# EAGLE design M837-pld-x (EAGLE 6.6.0)
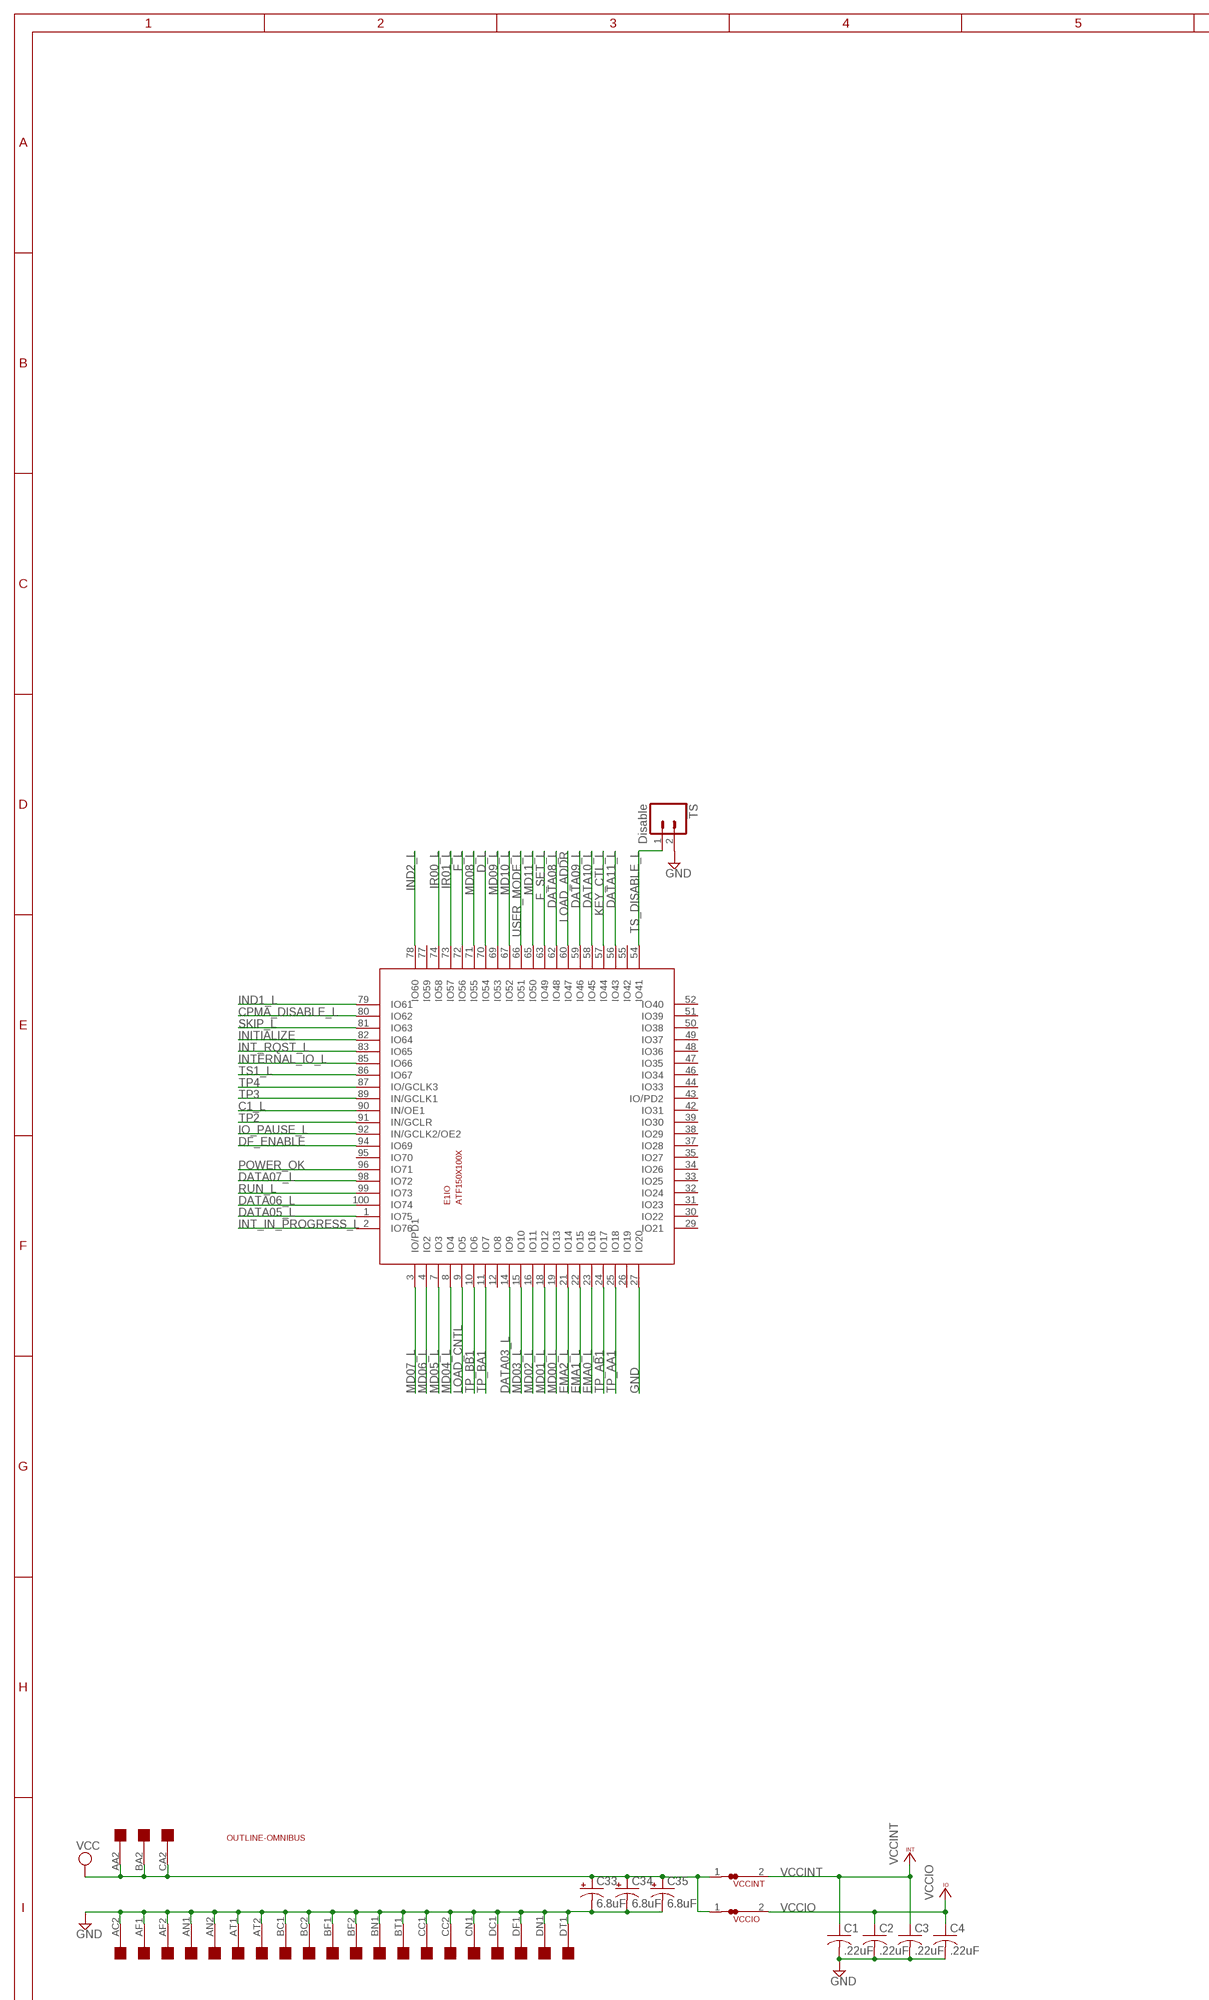
[diagram p0: schematic, sheet 1, part 1 of 2]
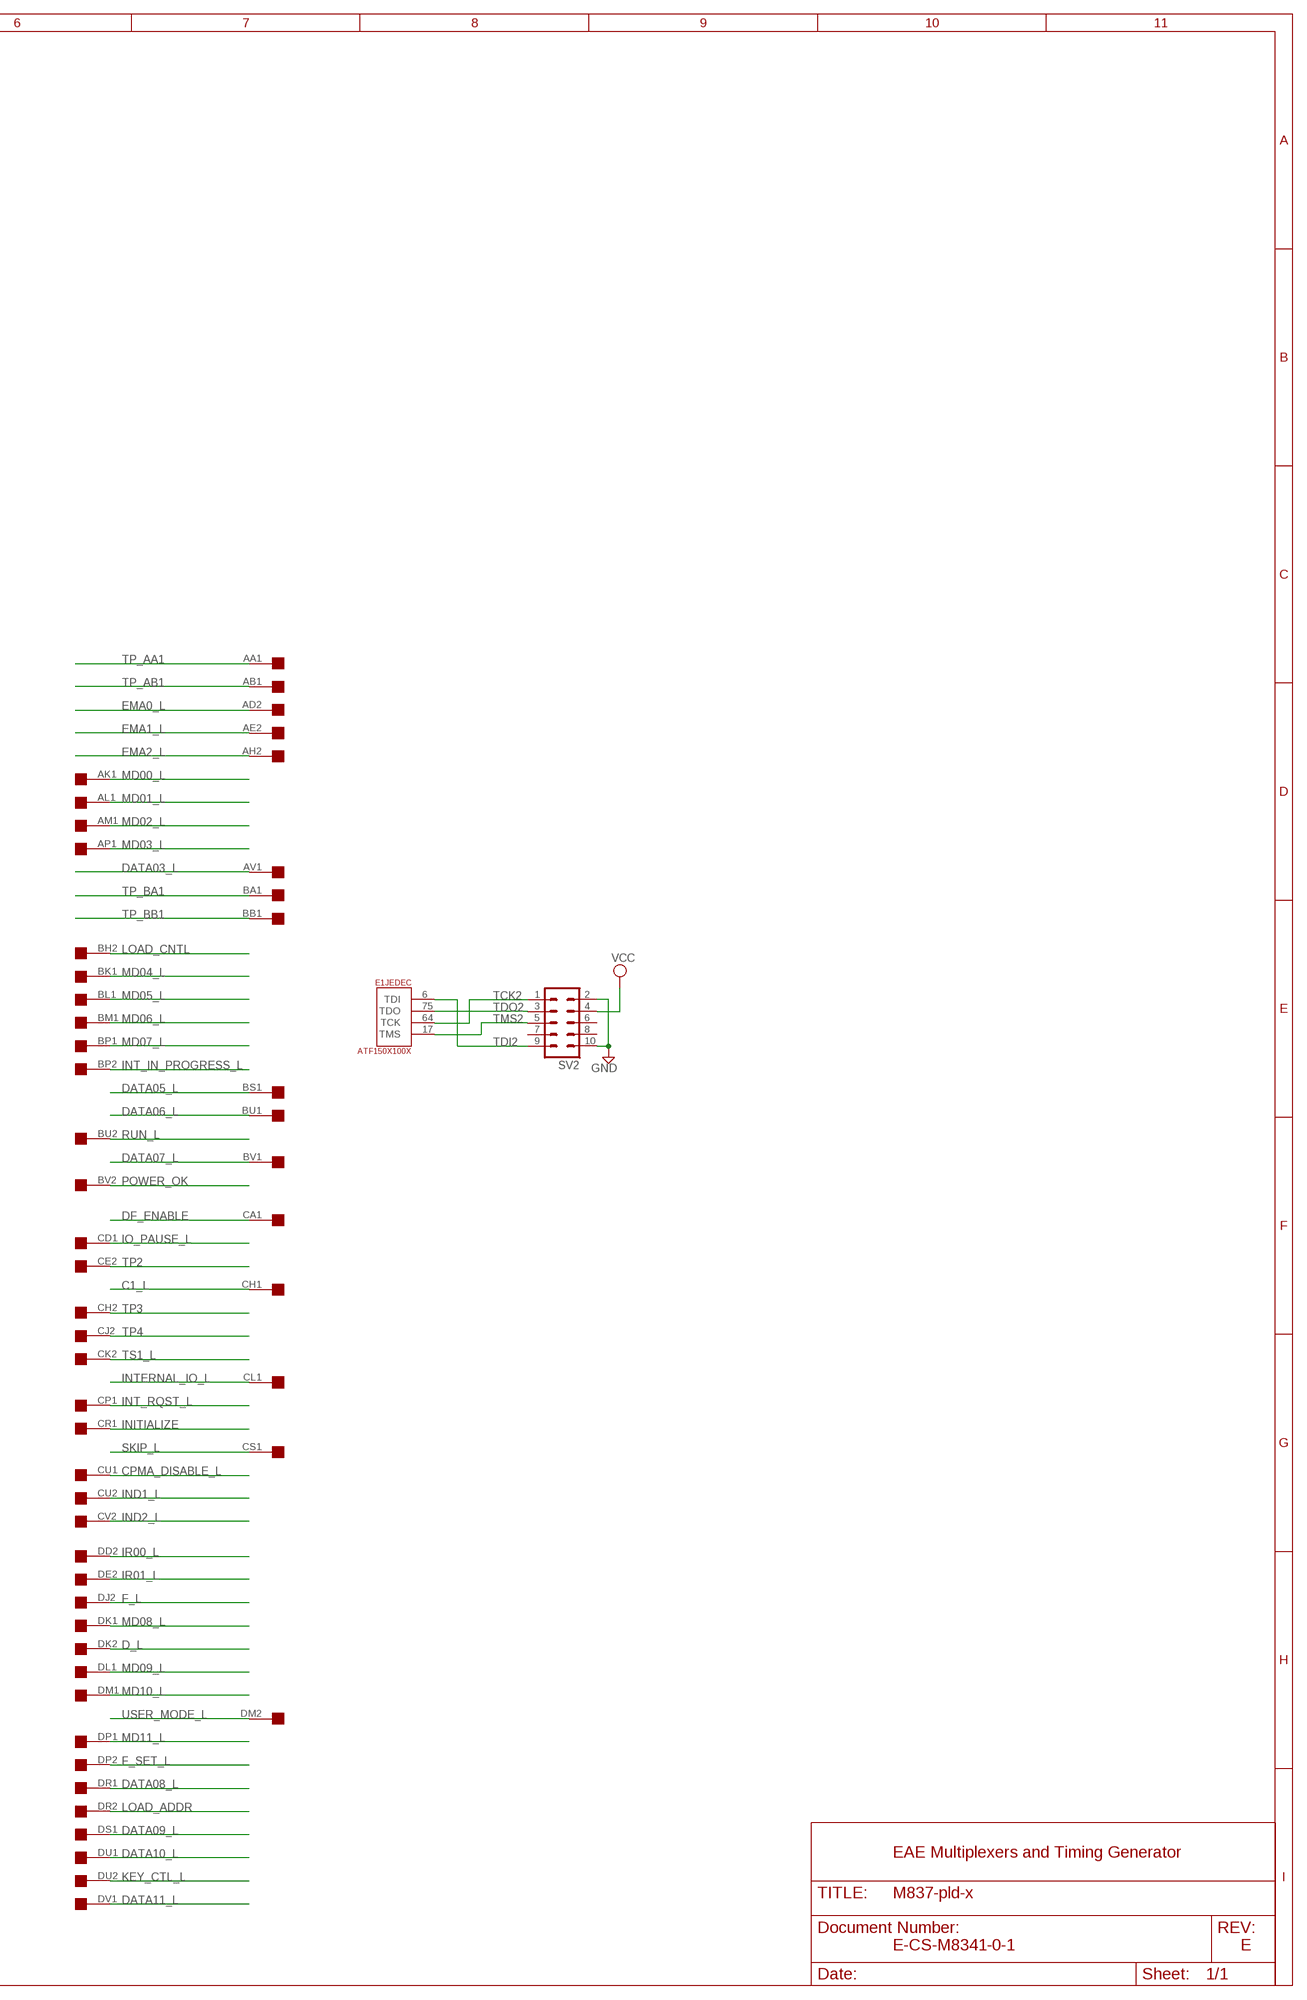
[diagram p1: schematic, sheet 1, part 2 of 2]

## Parts
!TS  Disable  M02  [02P]
C1  .22uF  C-US  [C063-025X075]
C2  .22uF  C-US  [C063-025X075]
C3  .22uF  C-US  [C063-025X075]
C4  .22uF  C-US  [C063-025X075]
C33  6.8uF  CPOL-USE20-8AXIAL  [E12-8]
C34  6.8uF  CPOL-USE20-8AXIAL  [E12-8]
C35  6.8uF  CPOL-USE20-8AXIAL  [E12-8]
E1  ATF150X100X  [TH100B]
SV2  ML10  [ML10]
U$1  QUAD  [EDGE-CON8]
U$2  OUTLINE-OMNIBUS  [OMNIBUS]
VCCINT  JUMPER-NC1  [NC1]
VCCIO  JUMPER-NC1  [NC1]

## Nets
C1_L: E1.90(IO:IN/OE1) U$1.CH1
CPMA_DISABLE_L: E1.80(IO:IO62) U$1.CU1
D_L: E1.70(IO:IO54) U$1.DK2
DATA03_L: E1.14(IO:IO9) U$1.AV1
DATA05_L: E1.1(IO:IO75) U$1.BS1
DATA06_L: E1.100(IO:IO74) U$1.BU1
DATA07_L: E1.98(IO:IO72) U$1.BV1
DATA08_L: E1.62(IO:IO48) U$1.DR1
DATA09_L: E1.59(IO:IO46) U$1.DS1
DATA10_L: E1.58(IO:IO45) U$1.DU1
DATA11_L: E1.56(IO:IO43) U$1.DV1
DF_ENABLE: E1.94(IO:IO69) U$1.CA1
EMA0_L: E1.23(IO:IO16) U$1.AD2
EMA1_L: E1.22(IO:IO15) U$1.AE2
EMA2_L: E1.21(IO:IO14) U$1.AH2
F_L: E1.72(IO:IO56) U$1.DJ2
F_SET_L: E1.63(IO:IO49) U$1.DP2
GND [supply]: !TS.2 C1.2 C2.2 C3.2 C4.2 C33.- C34.- C35.- E1.27(IO:IO20) SV2.2 SV2.10 U$1.AC2 U$1.AF1 U$1.AF2 U$1.AN1 U$1.AN2 U$1.AT1 U$1.AT2 U$1.BC1 U$1.BC2 U$1.BF1 U$1.BF2 U$1.BN1 U$1.BT1 U$1.CC1 U$1.CC2 U$1.CN1 U$1.DC1 U$1.DF1 U$1.DN1 U$1.DT1
IND1_L: E1.79(IO:IO61) U$1.CU2
IND2_L: E1.78(IO:IO60) U$1.CV2
INITIALIZE: E1.82(IO:IO64) U$1.CR1
INT_IN_PROGRESS_L: E1.2(IO:IO76) U$1.BP2
INT_RQST_L: E1.83(IO:IO65) U$1.CP1
INTERNAL_IO_L: E1.85(IO:IO66) U$1.CL1
IO_PAUSE_L: E1.92(IO:IN/GCLK2/OE2) U$1.CD1
IR00_L: E1.74(IO:IO58) U$1.DD2
IR01_L: E1.73(IO:IO57) U$1.DE2
KEY_CTL_L: E1.57(IO:IO44) U$1.DU2
LOAD_ADDR: E1.60(IO:IO47) U$1.DR2
LOAD_CNTL: E1.9(IO:IO5) U$1.BH2
MD00_L: E1.19(IO:IO13) U$1.AK1
MD01_L: E1.18(IO:IO12) U$1.AL1
MD02_L: E1.16(IO:IO11) U$1.AM1
MD03_L: E1.15(IO:IO10) U$1.AP1
MD04_L: E1.8(IO:IO4) U$1.BK1
MD05_L: E1.7(IO:IO3) U$1.BL1
MD06_L: E1.4(IO:IO2) U$1.BM1
MD07_L: E1.3(IO:IO/PD1) U$1.BP1
MD08_L: E1.71(IO:IO55) U$1.DK1
MD09_L: E1.69(IO:IO53) U$1.DL1
MD10_L: E1.67(IO:IO52) U$1.DM1
MD11_L: E1.65(IO:IO50) U$1.DP1
POWER_OK: E1.96(IO:IO71) U$1.BV2
RUN_L: E1.99(IO:IO73) U$1.BU2
SKIP_L: E1.81(IO:IO63) U$1.CS1
TCK2: E1.64(JEDEC:TCK) SV2.1
TDI2: E1.6(JEDEC:TDI) SV2.9
TDO2: E1.75(JEDEC:TDO) SV2.3
TMS2: E1.17(JEDEC:TMS) SV2.5
TP2: E1.91(IO:IN/GCLR) U$1.CE2
TP3: E1.89(IO:IN/GCLK1) U$1.CH2
TP4: E1.87(IO:IO/GCLK3) U$1.CJ2
TP_AA1: E1.25(IO:IO18) U$1.AA1
TP_AB1: E1.24(IO:IO17) U$1.AB1
TP_BA1: E1.11(IO:IO7) U$1.BA1
TP_BB1: E1.10(IO:IO6) U$1.BB1
TS1_L: E1.86(IO:IO67) U$1.CK2
TS_DISABLE_L: !TS.1 E1.54(IO:IO41)
USER_MODE_L: E1.66(IO:IO51) U$1.DM2
VCC [supply]: C33.+ C34.+ C35.+ SV2.4 U$1.AA2 U$1.BA2 U$1.CA2 VCCINT.1 VCCIO.1
VCCINT [supply]: C1.1 C3.1 VCCINT.2
VCCIO [supply]: C2.1 C4.1 VCCIO.2
Unconnected: E1.12(IO:IO8) E1.26(IO:IO19) E1.29(IO:IO21) E1.30(IO:IO22) E1.31(IO:IO23) E1.32(IO:IO24) E1.33(IO:IO25) E1.34(IO:IO26) E1.35(IO:IO27) E1.37(IO:IO28) E1.38(IO:IO29) E1.39(IO:IO30) E1.42(IO:IO31) E1.43(IO:IO/PD2) E1.44(IO:IO33) E1.46(IO:IO34) E1.47(IO:IO35) E1.48(IO:IO36) E1.49(IO:IO37) E1.50(IO:IO38) E1.51(IO:IO39) E1.52(IO:IO40) E1.55(IO:IO42) E1.77(IO:IO59) E1.95(IO:IO70) SV2.6 SV2.7 SV2.8 U$1.AB2 U$1.AC1 U$1.AD1 U$1.AE1 U$1.AH1 U$1.AJ1 U$1.AJ2 U$1.AK2 U$1.AL2 U$1.AM2 U$1.AP2 U$1.AR1 U$1.AR2 U$1.AS1 U$1.AS2 U$1.AU1 U$1.AU2 U$1.AV2 U$1.BB2 U$1.BD1 U$1.BD2 U$1.BE1 U$1.BE2 U$1.BH1 U$1.BJ1 U$1.BJ2 U$1.BK2 U$1.BL2 U$1.BM2 U$1.BN2 U$1.BR1 U$1.BR2 U$1.BS2 U$1.BT2 U$1.CB1 U$1.CB2 U$1.CD2 U$1.CE1 U$1.CF1 U$1.CF2 U$1.CJ1 U$1.CK1 U$1.CL2 U$1.CM1 U$1.CM2 U$1.CN2 U$1.CP2 U$1.CR2 U$1.CS2 U$1.CT1 U$1.CT2 U$1.CV1 U$1.DA1 U$1.DA2 U$1.DB1 U$1.DB2 U$1.DC2 U$1.DD1 U$1.DE1 U$1.DF2 U$1.DH1 U$1.DH2 U$1.DJ1 U$1.DL2 U$1.DN2 U$1.DS2 U$1.DT2 U$1.DV2

## Notes on the sheet
- EAE Multiplexers and Timing Generator
- E-CS-M8341-0-1 | E

## Power pins joined to a net without a drawn wire
GND: E1.13(GND) E1.28(GND) E1.40(GND) E1.45(GND) E1.61(GND) E1.76(GND) E1.88(GND) E1.97(GND) E1.P$24(GND) E1.P$26(GND) E1.P$28(GND) E1.P$30(GND)
VCCINT: E1.41(VCCINT) E1.93(VCCINT) E1.P$23(VCCINT) E1.P$25(VCCINT)
VCCIO: E1.5(VCCIO) E1.20(VCCIO) E1.36(VCCIO) E1.53(VCCIO) E1.68(VCCIO) E1.84(VCCIO) E1.P$27(VCCIO) E1.P$29(VCCIO) E1.VCCIO@1(VCCIO) E1.VCCIO@2(VCCIO)

## Library data of the parts
!TS = con-amp-quick:M02: AMP QUICK CONNECTOR; OC_FARNELL: unknown; OC_NEWARK: unknown
C1-C4 = dec-con:C-US: Capacitors with funky DEC lead spacing.
C33-C35 = dec-con:CPOL-USE20-8AXIAL: A 0.8 inch electrolytic.
E1 = atmel-cpld:ATF150X100: ATF150x in 100 pin package.
SV2 = con-harting-ml:ML10: HARTING; OC_FARNELL: unknown; OC_NEWARK: unknown
U$1 = dec-con:QUAD: Quad-Height DEC board
U$2 = dec-con:OUTLINE-*: Board outlines for DEC boards.
VCCINT VCCIO = dec-con:JUMPER: Normally closed SMD Jumper (Generates a DRC error.)

## Net classes
0 default: width 0.381 mm
1 supply: width 0.381 mm

## Board
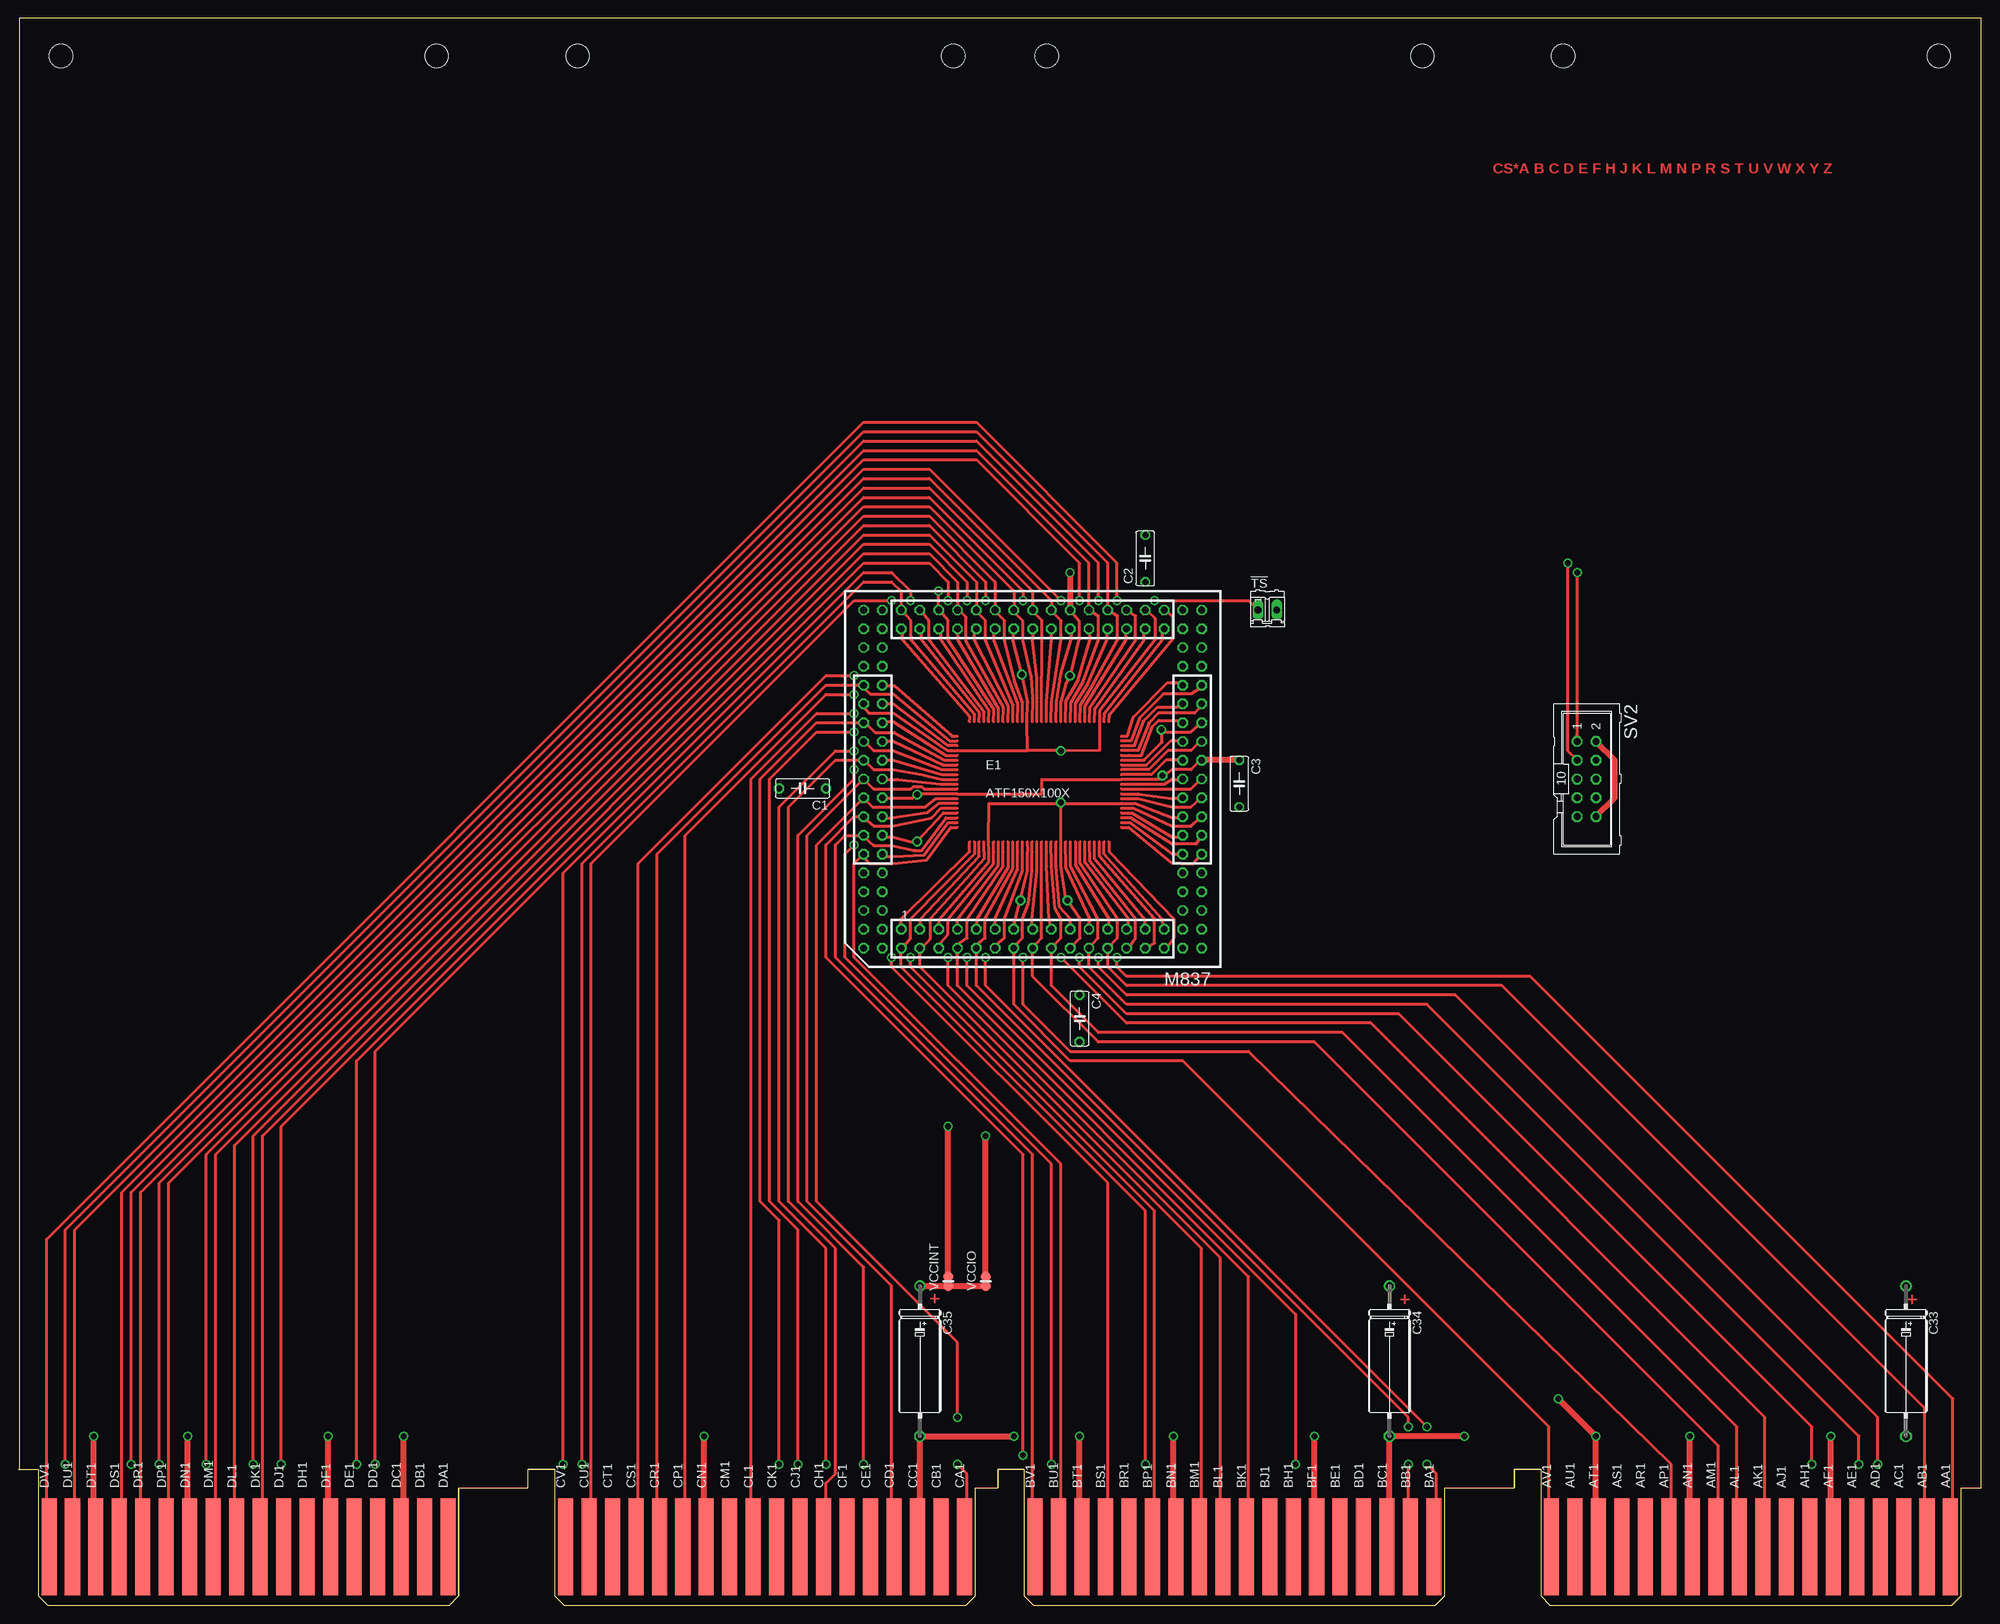
[diagram p2: board, top side]
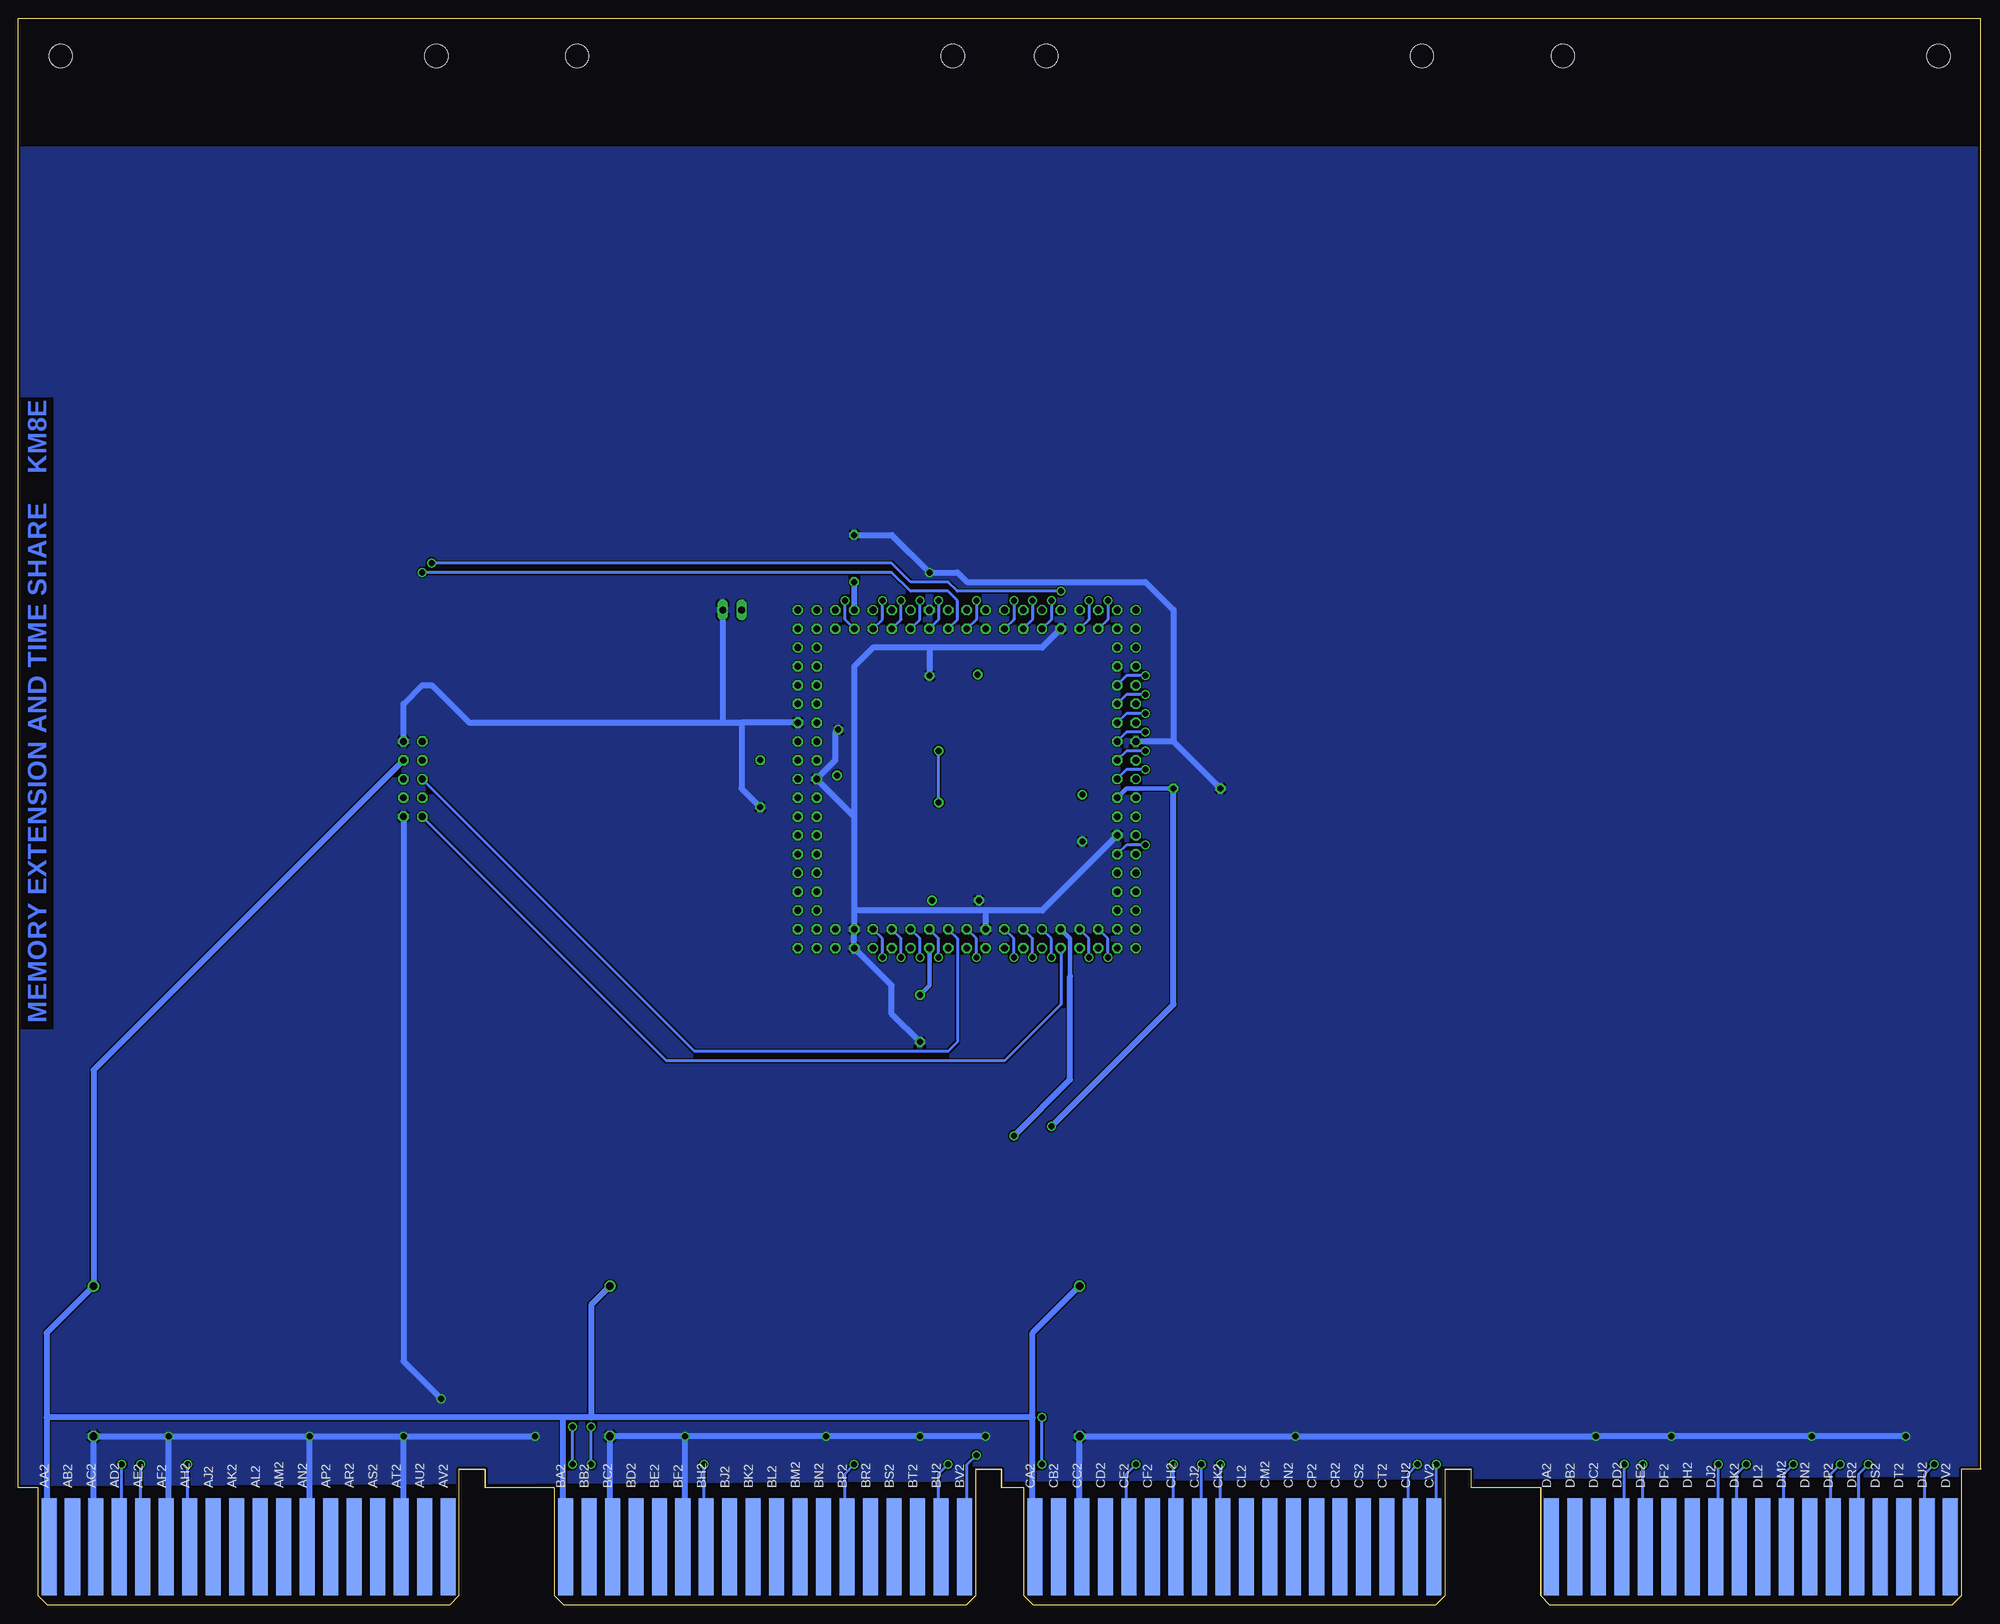
[diagram p3: board, bottom side, seen from below]

Size 265.43 x 214.63 mm. Coordinates in mm from the lower left corner, seen from the top.
Outline: 0,18.41 0.64,18.41
Copper layers (1+16): Top 0.035mm / dielectric 1.5mm / Bottom 0.035mm
Design rules "16mils *": minimum track width 16mil, minimum drill 32mil, track to track 7mil, track to pad 8mil, pad to pad 8mil, via to via 10mil, smd to smd 7mil, copper to edge 13mil, drill to drill 10mil, minimum pad ring 10mil, minimum via ring 8mil, stop-mask expansion 0mil, vias tented up to drill 0mil, thermal gap 10mil

### Footprints (pad centres in the part's own frame; a part is rotated, then mirrored left to right if it is on the bottom)
02P = drill 0.914 long: 1 -1.27,0; 2 1.27,0
C063-025X075 = drill 0.813 octagon: 1 -2.54,0; 2 3.81,0
E12-8 = drill 1.016: + -10.16,0 | drill 1.016 octagon: - 10.16,0
TH100B = drill 0.9 octagon: 1 -17.78,-20.32; 2 -17.78,-22.86; 3 -15.24,-20.32; 4 -15.24,-22.86; 5 -12.7,-20.32; 6 -12.7,-22.86; 7 -10.16,-20.32; 8 -10.16,-22.86; 9 -7.62,-20.32; 10 -7.62,-22.86; 11 -5.08,-20.32; 12 -5.08,-22.86; 13 -2.54,-20.32; 14 -2.54,-22.86; 15 0,-20.32; 16 0,-22.86; 17 2.54,-20.32; 18 2.54,-22.86; 19 5.08,-20.32; 20 5.08,-22.86; 21 7.62,-20.32; 22 7.62,-22.86; 23 10.16,-20.32; 24 10.16,-22.86; 25 12.7,-20.32; 26 12.7,-22.86; 27 15.24,-20.32; 28 15.24,-22.86; 29 17.78,-20.32; 30 17.78,-22.86; 31 22.86,-10.16; 32 20.32,-10.16; 33 22.86,-7.62; 34 20.32,-7.62; 35 22.86,-5.08; 36 20.32,-5.08; 37 22.86,-2.54; 38 20.32,-2.54; 39 22.86,0; 40 20.32,0; 41 22.86,2.54; 42 20.32,2.54; 43 22.86,5.08; 44 20.32,5.08; 45 22.86,7.62; 46 20.32,7.62; 47 22.86,10.16; 48 20.32,10.16; 49 22.86,12.7; 50 20.32,12.7; 51 17.78,22.86; 52 17.78,20.32; 53 15.24,22.86; 54 15.24,20.32; 55 12.7,22.86; 56 12.7,20.32; 57 10.16,22.86; 58 10.16,20.32; 59 7.62,22.86; 60 7.62,20.32; 61 5.08,22.86; 62 5.08,20.32; 63 2.54,22.86; 64 2.54,20.32; 65 0,22.86; 66 0,20.32; 67 -2.54,22.86; 68 -2.54,20.32; 69 -5.08,22.86; 70 -5.08,20.32; 71 -7.62,22.86; 72 -7.62,20.32; 73 -10.16,22.86; 74 -10.16,20.32; 75 -12.7,22.86; 76 -12.7,20.32; 77 -15.24,22.86; 78 -15.24,20.32; 79 -17.78,22.86; 80 -17.78,20.32; 81 -20.32,12.7; 82 -22.86,12.7; 83 -20.32,10.16; 84 -22.86,10.16; 85 -20.32,7.62; 86 -22.86,7.62; 87 -20.32,5.08; 88 -22.86,5.08; 89 -20.32,2.54; 90 -22.86,2.54; 91 -20.32,0; 92 -22.86,0; 93 -20.32,-2.54; 94 -22.86,-2.54; 95 -20.32,-5.08; 96 -22.86,-5.08; 97 -20.32,-7.62; 98 -22.86,-7.62; 99 -20.32,-10.16; 100 -22.86,-10.16; P$1 -22.86,15.24; P$2 -20.32,15.24; P$3 -20.32,17.78; P$4 -22.86,17.78; P$5 -20.32,20.32; P$6 -22.86,20.32; P$7 -22.86,22.86; P$8 -20.32,22.86; P$9 20.32,15.24; P$10 22.86,15.24; P$11 20.32,17.78; P$12 22.86,17.78; P$13 20.32,20.32; P$14 22.86,20.32; P$15 20.32,22.86; P$16 22.86,22.86; P$17 20.32,-17.78; P$18 22.86,-17.78; P$19 20.32,-15.24; P$20 22.86,-15.24; P$21 20.32,-12.7; P$22 22.86,-12.7; P$31 20.32,-22.86; P$32 22.86,-22.86; P$33 22.86,-20.32; P$34 20.32,-20.32; P$35 -20.32,-22.86; P$36 -20.32,-20.32; P$37 -22.86,-20.32; P$38 -22.86,-22.86; P$39 -22.86,-17.78; P$40 -20.32,-17.78; P$41 -22.86,-15.24; P$42 -20.32,-15.24; P$43 -22.86,-12.7; P$44 -20.32,-12.7 | drill 0.813: P$23 17.556,0.488; P$24 17.394,6.665; P$25 -15.606,-2.113; P$26 -15.606,-8.453; P$27 4.714,-16.419; P$28 -1.626,-16.419; P$29 -1.463,14.143; P$30 5.039,13.98; VCCIO@1 3.81,3.81; VCCIO@2 3.81,-3.175
ML10 = drill 0.914 octagon: 1 -5.08,-1.27; 2 -5.08,1.27; 3 -2.54,-1.27; 4 -2.54,1.27; 5 0,-1.27; 6 0,1.27; 7 2.54,-1.27; 8 2.54,1.27; 9 5.08,-1.27; 10 5.08,1.27
EDGE-CON8 = smd 2.032 x 13.106: AA1 261.303,7.938; AB1 258.127,7.938; AC1 254.952,7.938; AD1 251.778,7.938; AE1 248.602,7.938; AF1 245.428,7.938; AH1 242.252,7.938; AJ1 239.077,7.938; AK1 235.903,7.938; AL1 232.727,7.938; AM1 229.553,7.938; AN1 226.377,7.938; AP1 223.202,7.938; AR1 220.028,7.938; AS1 216.852,7.938; AT1 213.678,7.938; AU1 210.502,7.938; AV1 207.327,7.938; BA1 191.452,7.938; BB1 188.278,7.938; BC1 185.102,7.938; BD1 181.928,7.938; BE1 178.752,7.938; BF1 175.577,7.938; BH1 172.403,7.938; BJ1 169.227,7.938; BK1 166.053,7.938; BL1 162.877,7.938; BM1 159.702,7.938; BN1 156.528,7.938; BP1 153.352,7.938; BR1 150.178,7.938; BS1 147.002,7.938; BT1 143.827,7.938; BU1 140.653,7.938; BV1 137.477,7.938; CA1 127.953,7.938; CB1 124.778,7.938; CC1 121.603,7.938; CD1 118.427,7.938; CE1 115.252,7.938; CF1 112.078,7.938; CH1 108.903,7.938; CJ1 105.728,7.938; CK1 102.552,7.938; CL1 99.377,7.938; CM1 96.203,7.938; CN1 93.028,7.938; CP1 89.853,7.938; CR1 86.677,7.938; CS1 83.502,7.938; CT1 80.328,7.938; CU1 77.153,7.938; CV1 73.978,7.938; DA1 58.102,7.938; DB1 54.928,7.938; DC1 51.752,7.938; DD1 48.578,7.938; DE1 45.403,7.938; DF1 42.227,7.938; DH1 39.053,7.938; DJ1 35.877,7.938; DK1 32.703,7.938; DL1 29.527,7.938; DM1 26.352,7.938; DN1 23.177,7.938; DP1 20.003,7.938; DR1 16.828,7.938; DS1 13.652,7.938; DT1 10.477,7.938; DU1 7.303,7.938; DV1 4.128,7.938 | smd 2.032 x 13.106 bottom: AA2 261.303,7.938; AB2 258.127,7.938; AC2 254.952,7.938; AD2 251.778,7.938; AE2 248.602,7.938; AF2 245.428,7.938; AH2 242.252,7.938; AJ2 239.077,7.938; AK2 235.903,7.938; AL2 232.727,7.938; AM2 229.553,7.938; AN2 226.377,7.938; AP2 223.202,7.938; AR2 220.028,7.938; AS2 216.852,7.938; AT2 213.678,7.938; AU2 210.502,7.938; AV2 207.327,7.938; BA2 191.452,7.938; BB2 188.278,7.938; BC2 185.102,7.938; BD2 181.928,7.938; BE2 178.752,7.938; BF2 175.577,7.938; BH2 172.403,7.938; BJ2 169.227,7.938; BK2 166.053,7.938; BL2 162.877,7.938; BM2 159.702,7.938; BN2 156.528,7.938; BP2 153.352,7.938; BR2 150.178,7.938; BS2 147.002,7.938; BT2 143.827,7.938; BU2 140.653,7.938; BV2 137.477,7.938; CA2 127.953,7.938; CB2 124.778,7.938; CC2 121.603,7.938; CD2 118.427,7.938; CE2 115.252,7.938; CF2 112.078,7.938; CH2 108.903,7.938; CJ2 105.728,7.938; CK2 102.552,7.938; CL2 99.377,7.938; CM2 96.203,7.938; CN2 93.028,7.938; CP2 89.853,7.938; CR2 86.677,7.938; CS2 83.502,7.938; CT2 80.328,7.938; CU2 77.153,7.938; CV2 73.978,7.938; DA2 58.102,7.938; DB2 54.928,7.938; DC2 51.752,7.938; DD2 48.578,7.938; DE2 45.403,7.938; DF2 42.227,7.938; DH2 39.053,7.938; DJ2 35.877,7.938; DK2 32.703,7.938; DL2 29.527,7.938; DM2 26.352,7.938; DN2 23.177,7.938; DP2 20.003,7.938; DR2 16.828,7.938; DS2 13.652,7.938; DT2 10.477,7.938; DU2 7.303,7.938; DV2 4.128,7.938
OMNIBUS = hole 3.175: 208.915,209.55; 259.715,209.55; 189.865,209.55; 139.065,209.55; 75.616,209.55; 126.416,209.55; 56.566,209.55; 5.766,209.55
NC1 = smd 1.346 x 1.346: 1 -0.635,0; 2 0.635,0

### Placement (x,y rotation side)
!TS  168.91,134.62 0 top
C1  106.68,110.49 180 top
C2  152.4,140.97 90 top
C3  165.1,111.76 270 top
C4  143.51,80.01 270 top
C33  255.27,33.02 270 top
C34  185.42,33.02 270 top
C35  121.92,33.02 270 top
E1  137.16,111.76 0 top
SV2  212.09,111.76 270 top
U$1  0,0 0 top
U$2  0,0 0 top
VCCINT  125.73,43.81 90 top
VCCIO  130.81,43.81 90 top

### Tracks (layer width: path | path; a pad name or v marks a point on that pad's centre or on a via)
C1_L
  Top 0.406: U$1.CH1 108.9,8.57 109.22,8.89 109.22,16.51 110.49,17.78 110.49,48.26 104.14,54.61 104.14,107.95 110.49,114.3 E1.90
CPMA_DISABLE_L  (via drill 0.81)
  Top 0.406: U$1.CU1 77.15,9.84 77.47,10.16 77.47,100.33 113.03,135.89 v118.11,135.89
  Bottom 0.406: v118.11,135.89 118.11,133.35 E1.80
D_L  (via drill 0.81)
  Top 0.406: v31.75,19.05 31.75,63.5 114.3,146.05 123.19,146.05 130.81,138.43 v130.81,135.89
  Bottom 0.406: U$1.DK2 32.7,8.57 33.02,8.89 33.02,17.78 v31.75,19.05 | v130.81,135.89 130.81,133.35 E1.70
DATA03_L
  Top 0.406: U$1.AV1 207.33,8.57 207.01,8.89 207.01,24.13 157.48,73.66 142.24,73.66 134.62,81.28 E1.14
DATA05_L  (via drill 0.81)
  Top 0.406: U$1.BS1 147,9.84 147.32,10.16 147.32,57.15 118.11,86.36 v118.11,87.63
  Bottom 0.406: v118.11,87.63 118.11,90.17 E1.1
DATA06_L
  Top 0.406: U$1.BU1 140.65,8.57 140.97,8.89 140.97,59.69 113.03,87.63 113.03,100.33 E1.100
DATA07_L
  Top 0.406: U$1.BV1 137.48,8.57 137.16,8.89 137.16,60.96 110.49,87.63 110.49,102.87 111.76,104.14 E1.98
DATA08_L  (via drill 0.81)
  Top 0.406: U$1.DR1 16.51,7.62 16.51,55.88 114.3,153.67 123.19,153.67 v140.97,135.89
  Bottom 0.406: v140.97,135.89 140.97,133.35 E1.62
DATA09_L
  Top 0.406: U$1.DS1 13.65,8.57 13.97,8.89 13.97,55.88 114.3,156.21 129.54,156.21 144.78,140.97 E1.59
DATA10_L  (via drill 0.81)
  Top 0.406: U$1.DU1 7.3,8.57 7.62,8.89 7.62,50.8 114.3,157.48 129.54,157.48 146.05,140.97 v146.05,135.89
  Bottom 0.406: E1.58 146.05,133.35 v146.05,135.89
DATA11_L  (via drill 0.81)
  Top 0.406: U$1.DV1 3.81,7.94 3.81,49.53 114.3,160.02 129.54,160.02 148.59,140.97 v148.59,135.89
  Bottom 0.406: E1.56 148.59,133.35 v148.59,135.89
DF_ENABLE  (via drill 0.81)
  Top 0.406: U$1.CA1 127.95,8.57 128.27,8.89 128.27,17.78 v127,19.05 | v127,25.4 127,35.56 107.95,54.61 107.95,102.87 E1.94
  Bottom 0.406: v127,19.05 v127,25.4
EMA0_L  (via drill 0.81)
  Top 0.406: v251.46,19.05 251.46,25.4 194.31,82.55 149.86,82.55 146.05,86.36 v146.05,87.63
  Bottom 0.406: U$1.AD2 251.78,8.57 251.46,8.89 v251.46,19.05 | v146.05,87.63 146.05,90.17 E1.23
EMA1_L  (via drill 0.81)
  Top 0.406: v248.92,19.05 248.92,22.86 190.5,81.28 149.86,81.28 144.78,86.36 E1.22
  Bottom 0.406: U$1.AE2 248.6,9.84 248.92,10.16 v248.92,19.05
EMA2_L  (via drill 0.81)
  Top 0.406: v242.57,19.05 242.57,24.13 186.69,80.01 149.86,80.01 143.51,86.36 v143.51,87.63
  Bottom 0.406: U$1.AH2 242.25,8.57 242.57,8.89 v242.57,19.05 | v143.51,87.63 143.51,90.17 E1.21
F_L  (via drill 0.81)
  Top 0.406: v35.56,19.05 35.56,64.77 114.3,143.51 123.19,143.51 128.27,138.43 v128.27,135.89
  Bottom 0.406: U$1.DJ2 35.56,8.89 v35.56,19.05 | v128.27,135.89 128.27,133.35 E1.72
F_SET_L  (via drill 0.81)
  Top 0.406: v19.05,19.05 19.05,57.15 114.3,152.4 123.19,152.4 139.7,135.89 E1.63
  Bottom 0.406: U$1.DP2 20,8.57 20.32,8.89 20.32,17.78 v19.05,19.05
GND  (via drill 0.81, 0.81 pad 0.3)
  Top 0.813: U$1.DT1 10.16,8.89 v10.16,22.86 | v195.58,22.86 C34.- 185.42,8.89 U$1.BC2 | U$1.DN1 22.86,7.62 v22.86,22.86 | U$1.DF1 41.91,8.89 v41.91,22.86 | U$1.DC1 52.07,8.89 v52.07,22.86 | v134.62,22.86 C35.- 121.92,8.89 U$1.CC2 | U$1.CN1 92.71,8.89 v92.71,22.86 | U$1.BF2 175.26,8.89 v175.26,22.86 | U$1.BN1 156.21,8.89 v156.21,22.86 | U$1.BT1 143.51,8.89 v143.51,22.86 | U$1.AT1 213.68,8.57 213.36,8.89 v213.36,22.86 v208.28,27.94 | U$1.AN1 226.38,8.57 226.06,8.89 v226.06,22.86 | U$1.AF1 245.43,8.57 245.11,8.89 v245.11,22.86 | v142.24,139.7 E1.61 | SV2.10 215.9,109.22 215.9,114.3 SV2.2
  Bottom 0.813: v10.16,22.86 v22.86,22.86 v41.91,22.86 v52.07,22.86 v92.71,22.86 C35.- 121.92,8.89 U$1.CC2 | v245.11,22.86 C33.- 255.27,10.16 U$1.AC2 | v245.11,22.86 v226.06,22.86 | v226.06,22.86 v213.36,22.86 | v213.36,22.86 v195.58,22.86 | v134.62,22.86 v143.51,22.86 v156.21,22.86 v175.26,22.86 | U$1.BF2 175.26,8.89 v175.26,22.86 | U$1.BC2 185.42,8.89 C34.- v175.26,22.86 | U$1.AT1 213.68,8.57 213.36,8.89 v213.36,22.86 | U$1.AN1 226.38,8.57 226.06,8.89 v226.06,22.86 | U$1.AF1 245.43,8.57 245.11,8.89 v245.11,22.86 | C4.2 147.32,80.01 147.32,83.82 E1.28 E1.27 152.4,93.98 | C1.2 109.22,116.84 | C2.2 147.32,144.78 v142.24,139.7 138.43,139.7 137.16,138.43 113.03,138.43 109.22,134.62 109.22,116.84 | E1.45 167.64,119.38 | 167.64,119.38 167.64,110.49 C3.2 | 109.22,116.84 E1.88 | E1.97 127,93.98 134.62,93.98 | 134.62,93.98 E1.13 | 134.62,93.98 152.4,93.98 | 152.4,106.68 E1.40 154.94,114.3 154.94,118.04 E1.P$24 | 152.4,106.68 152.4,93.98 | E1.76 127,129.54 142.24,129.54 | 142.24,129.54 149.86,129.54 152.4,127 152.4,106.68 | SV2.2 213.36,121.92 210.82,124.46 209.55,124.46 204.47,119.38 170.18,119.38 | 170.18,119.38 167.64,119.38 | !TS.2 170.18,119.38 | SV2.10 213.36,33.02 v208.28,27.94 | 142.24,129.54 142.24,125.78 E1.P$30
  pour Bottom: 0,17.78 0,196.85 265.43,196.85 265.43,163.83 260.35,163.83 260.35,77.47 265.43,77.47 265.43,16.51
IND1_L  (via drill 0.81)
  Top 0.406: v76.2,19.05 76.2,100.33 114.3,138.43 118.11,138.43 119.38,137.16 E1.79
  Bottom 0.406: U$1.CU2 77.15,8.57 77.47,8.89 77.47,17.78 v76.2,19.05
IND2_L  (via drill 0.81)
  Top 0.406: v73.66,19.05 73.66,99.06 114.3,139.7 118.11,139.7 120.65,137.16 v120.65,135.89
  Bottom 0.406: U$1.CV2 73.98,9.84 73.66,10.16 v73.66,19.05 | v120.65,135.89 120.65,133.35 E1.78
INITIALIZE
  Top 0.406: U$1.CR1 86.68,8.57 86.36,8.89 86.36,101.6 109.22,124.46 E1.82
INT_IN_PROGRESS_L  (via drill 0.81)
  Top 0.406: v152.4,19.05 152.4,53.34 119.38,86.36 E1.2
  Bottom 0.406: U$1.BP2 153.35,8.57 153.67,8.89 153.67,17.78 v152.4,19.05
INT_RQST_L  (via drill 0.81)
  Top 0.406: U$1.CP1 89.85,8.57 90.17,8.89 90.17,104.14 109.22,123.19 v113.03,123.19
  Bottom 0.406: v113.03,123.19 115.57,123.19 E1.83
INTERNAL_IO_L  (via drill 0.81)
  Top 0.406: U$1.CL1 99.38,8.57 99.06,8.89 99.06,111.76 107.95,120.65 v113.03,120.65
  Bottom 0.406: v113.03,120.65 115.57,120.65 E1.85
IO_PAUSE_L
  Top 0.406: U$1.CD1 118.43,8.57 118.11,8.89 118.11,43.18 106.68,54.61 106.68,104.14 E1.92
IR00_L  (via drill 0.81)
  Top 0.406: v48.26,19.05 48.26,74.93 114.3,140.97 123.19,140.97 125.73,138.43 v125.73,135.89
  Bottom 0.406: U$1.DD2 48.58,8.57 48.26,8.89 v48.26,19.05 | v125.73,135.89 125.73,133.35 E1.74
IR01_L  (via drill 0.81)
  Top 0.406: v45.72,19.05 45.72,73.66 114.3,142.24 123.19,142.24 127,138.43 E1.73
  Bottom 0.406: U$1.DE2 45.4,9.84 45.72,10.16 v45.72,19.05
KEY_CTL_L  (via drill 0.81)
  Top 0.406: v6.35,19.05 6.35,50.8 114.3,158.75 129.54,158.75 147.32,140.97 E1.57
  Bottom 0.406: U$1.DU2 7.3,8.57 7.62,8.89 7.62,17.78 v6.35,19.05
LOAD_ADDR  (via drill 0.81)
  Top 0.406: v15.24,19.05 15.24,55.88 114.3,154.94 129.54,154.94 143.51,140.97 v143.51,135.89
  Bottom 0.406: U$1.DR2 16.83,8.57 16.51,8.89 16.51,17.78 v15.24,19.05 | E1.60 143.51,133.35 v143.51,135.89
LOAD_CNTL  (via drill 0.81)
  Top 0.406: v172.72,19.05 172.72,39.37 128.27,83.82 v128.27,87.63
  Bottom 0.406: U$1.BH2 172.4,8.57 172.72,8.89 v172.72,19.05 | v128.27,87.63 128.27,90.17 E1.9
MD00_L  (via drill 0.81)
  Top 0.406: U$1.AK1 235.9,8.57 236.22,8.89 236.22,25.4 182.88,78.74 149.86,78.74 v140.97,87.63
  Bottom 0.406: v140.97,87.63 140.97,90.17 E1.19
MD01_L
  Top 0.406: U$1.AL1 232.73,8.57 232.41,8.89 232.41,24.13 179.07,77.47 146.05,77.47 139.7,83.82 E1.18
MD02_L
  Top 0.406: U$1.AM1 229.55,8.57 229.87,8.89 229.87,21.59 175.26,76.2 146.05,76.2 137.16,85.09 E1.16
MD03_L  (via drill 0.81)
  Top 0.406: U$1.AP1 223.2,8.57 223.52,8.89 223.52,19.05 166.37,74.93 142.24,74.93 135.89,81.28 v135.89,87.63
  Bottom 0.406: v135.89,87.63 135.89,90.17 E1.15
MD04_L
  Top 0.406: U$1.BK1 166.05,8.57 166.37,8.89 166.37,44.45 127,83.82 E1.8
MD05_L  (via drill 0.81)
  Top 0.406: U$1.BL1 162.88,8.57 162.56,8.89 162.56,46.99 125.73,83.82 v125.73,87.63
  Bottom 0.406: v125.73,87.63 125.73,90.17 E1.7
MD06_L
  Top 0.406: U$1.BM1 159.7,8.57 160.02,8.89 160.02,48.26 121.92,86.36 E1.4
MD07_L  (via drill 0.81)
  Top 0.406: U$1.BP1 153.35,8.57 153.67,8.89 153.67,53.34 120.65,86.36 v120.65,87.63
  Bottom 0.406: v120.65,87.63 120.65,90.17 E1.3
MD08_L
  Top 0.406: U$1.DK1 32.7,8.57 33.02,8.89 33.02,63.5 114.3,144.78 123.19,144.78 129.54,138.43 E1.71
MD09_L
  Top 0.406: U$1.DL1 29.53,9.84 29.21,10.16 29.21,62.23 114.3,147.32 123.19,147.32 132.08,138.43 E1.69
MD10_L
  Top 0.406: U$1.DM1 26.35,8.57 26.67,8.89 26.67,60.96 114.3,148.59 123.19,148.59 134.62,137.16 E1.67
MD11_L
  Top 0.406: U$1.DP1 20,8.57 20.32,8.89 20.32,57.15 114.3,151.13 123.19,151.13 137.16,137.16 E1.65
POWER_OK  (via drill 0.81)
  Top 0.406: v135.89,20.32 135.89,60.96 109.22,87.63 109.22,102.87 113.03,106.68 E1.96
  Bottom 0.406: U$1.BV2 137.48,8.57 137.16,8.89 137.16,19.05 v135.89,20.32
RUN_L  (via drill 0.81)
  Top 0.406: v139.7,19.05 139.7,59.69 111.76,87.63 111.76,101.6 v113.03,102.87
  Bottom 0.406: U$1.BU2 140.65,11.11 140.97,11.43 140.97,17.78 v139.7,19.05 | v113.03,102.87 115.57,102.87 E1.99
SKIP_L  (via drill 0.81)
  Top 0.406: U$1.CS1 83.82,8.89 83.82,100.33 109.22,125.73 v113.03,125.73
  Bottom 0.406: v113.03,125.73 115.57,125.73 E1.81
TCK2  (via drill 0.81)
  Top 0.406: SV2.1 v210.82,139.7
  Bottom 0.406: E1.64 138.43,133.35 138.43,135.89 139.7,137.16 144.78,137.16 147.32,139.7 v210.82,139.7
TDI2
  Bottom 0.406: E1.6 124.46,81.28 132.08,73.66 177.8,73.66 SV2.9
TDO2  (via drill 0.81)
  Top 0.406: E1.75 v124.46,137.16 | SV2.3 209.55,115.57 v209.55,140.97
  Bottom 0.406: v124.46,137.16 138.43,137.16 139.7,138.43 144.78,138.43 147.32,140.97 v209.55,140.97
TMS2
  Bottom 0.406: E1.17 138.43,90.17 138.43,76.2 139.7,74.93 173.99,74.93 SV2.5
TP2  (via drill 0.81)
  Top 0.406: v114.3,19.05 114.3,45.72 105.41,54.61 105.41,104.14 113.03,111.76 v113.03,113.03
  Bottom 0.406: U$1.CE2 115.25,8.57 115.57,8.89 115.57,17.78 v114.3,19.05 | v113.03,113.03 115.57,113.03 E1.91
TP3  (via drill 0.81)
  Top 0.406: v109.22,19.05 109.22,48.26 102.87,54.61 102.87,107.95 110.49,115.57 v113.03,115.57
  Bottom 0.406: U$1.CH2 108.9,8.57 109.22,8.89 v109.22,19.05 | v113.03,115.57 115.57,115.57 E1.89
TP4  (via drill 0.81)
  Top 0.406: v105.41,19.05 105.41,50.8 101.6,54.61 101.6,111.76 107.95,118.11 v113.03,118.11
  Bottom 0.406: U$1.CJ2 105.73,8.57 105.41,8.89 v105.41,19.05 | v113.03,118.11 115.57,118.11 E1.87
TP_AA1  (via drill 0.81)
  Top 0.406: U$1.AA1 261.3,8.57 261.62,8.89 261.62,27.94 204.47,85.09 149.86,85.09 148.59,86.36 v148.59,87.63
  Bottom 0.406: v148.59,87.63 148.59,90.17 E1.25
TP_AB1
  Top 0.406: U$1.AB1 258.13,8.57 257.81,8.89 257.81,26.67 200.66,83.82 149.86,83.82 147.32,86.36 E1.24
TP_BA1  (via drill 0.81)
  Top 0.406: U$1.BA1 191.45,8.57 191.77,8.89 191.77,17.78 v190.5,19.05 | v190.5,24.13 130.81,83.82 v130.81,87.63
  Bottom 0.406: v190.5,19.05 v190.5,24.13 | v130.81,87.63 130.81,90.17 E1.11
TP_BB1  (via drill 0.81)
  Top 0.406: U$1.BB1 188.28,9.84 187.96,10.16 v187.96,19.05 | v187.96,24.13 187.96,25.4 129.54,83.82 E1.10
  Bottom 0.406: v187.96,19.05 v187.96,24.13
TS1_L  (via drill 0.81)
  Top 0.406: v102.87,19.05 102.87,52.07 100.33,54.61 100.33,111.76 107.95,119.38 E1.86
  Bottom 0.406: U$1.CK2 102.55,8.57 102.87,8.89 v102.87,19.05
TS_DISABLE_L  (via drill 0.81)
  Top 0.406: v153.67,135.89 166.37,135.89 !TS.1
  Bottom 0.406: E1.54 153.67,133.35 v153.67,135.89
USER_MODE_L  (via drill 0.81)
  Top 0.406: v25.4,19.05 25.4,60.96 114.3,149.86 123.19,149.86 135.89,137.16 v135.89,135.89
  Bottom 0.406: U$1.DM2 26.67,7.62 26.67,17.78 v25.4,19.05 | v135.89,135.89 135.89,133.35 E1.66
VCC
  Top 0.813: C35.+ VCCINT.1 VCCIO.1
  Bottom 0.813: 261.62,25.4 261.62,36.83 C33.+ 255.27,72.39 SV2.4 | 261.62,25.4 261.62,8.89 U$1.AA2 | U$1.BA2 191.77,8.89 191.77,25.4 | 191.77,25.4 261.62,25.4 | U$1.CA2 128.27,8.89 128.27,25.4 | 128.27,25.4 187.96,25.4 | 187.96,25.4 191.77,25.4 | 128.27,25.4 128.27,36.83 C35.+ | C34.+ 187.96,40.64 187.96,25.4
VCCINT  (via drill 0.81)
  Top 0.813: C3.1 E1.41 | VCCINT.2 v125.73,64.77
  Bottom 0.61: C1.1 115.57,110.49 E1.93
  Bottom 0.813: v125.73,64.77 109.22,81.28 C1.1
VCCIO  (via drill 0.81)
  Top 0.813: VCCIO.2 v130.81,63.5
  Bottom 0.61: C4.1 142.24,83.82 E1.20 | E1.5 123.19,90.17 123.19,85.09
  Bottom 0.813: C2.1 E1.53 | v130.81,63.5 123.19,71.12 123.19,85.09

### Text on the board
Top: CS*A B C D E F H J K L M N P R S T U V W X Y Z | + | + | +
Bottom: KM8E | MEMORY EXTENSION AND TIME SHARE
tPlace: M837